# EasyEDA Pro project 8_led_51.eprj

# Schematic 八位LED_51

## Sheets
1 主体: Board Name: Board1; Create Date: 2025-12-03; Page Name: 主体; Project Name: 8_led_51; Schematic Name: 八位LED_51; Update Date: 2025-12-07; Company: 嘉立创EDA; Page Size: A4; Version: V1.0
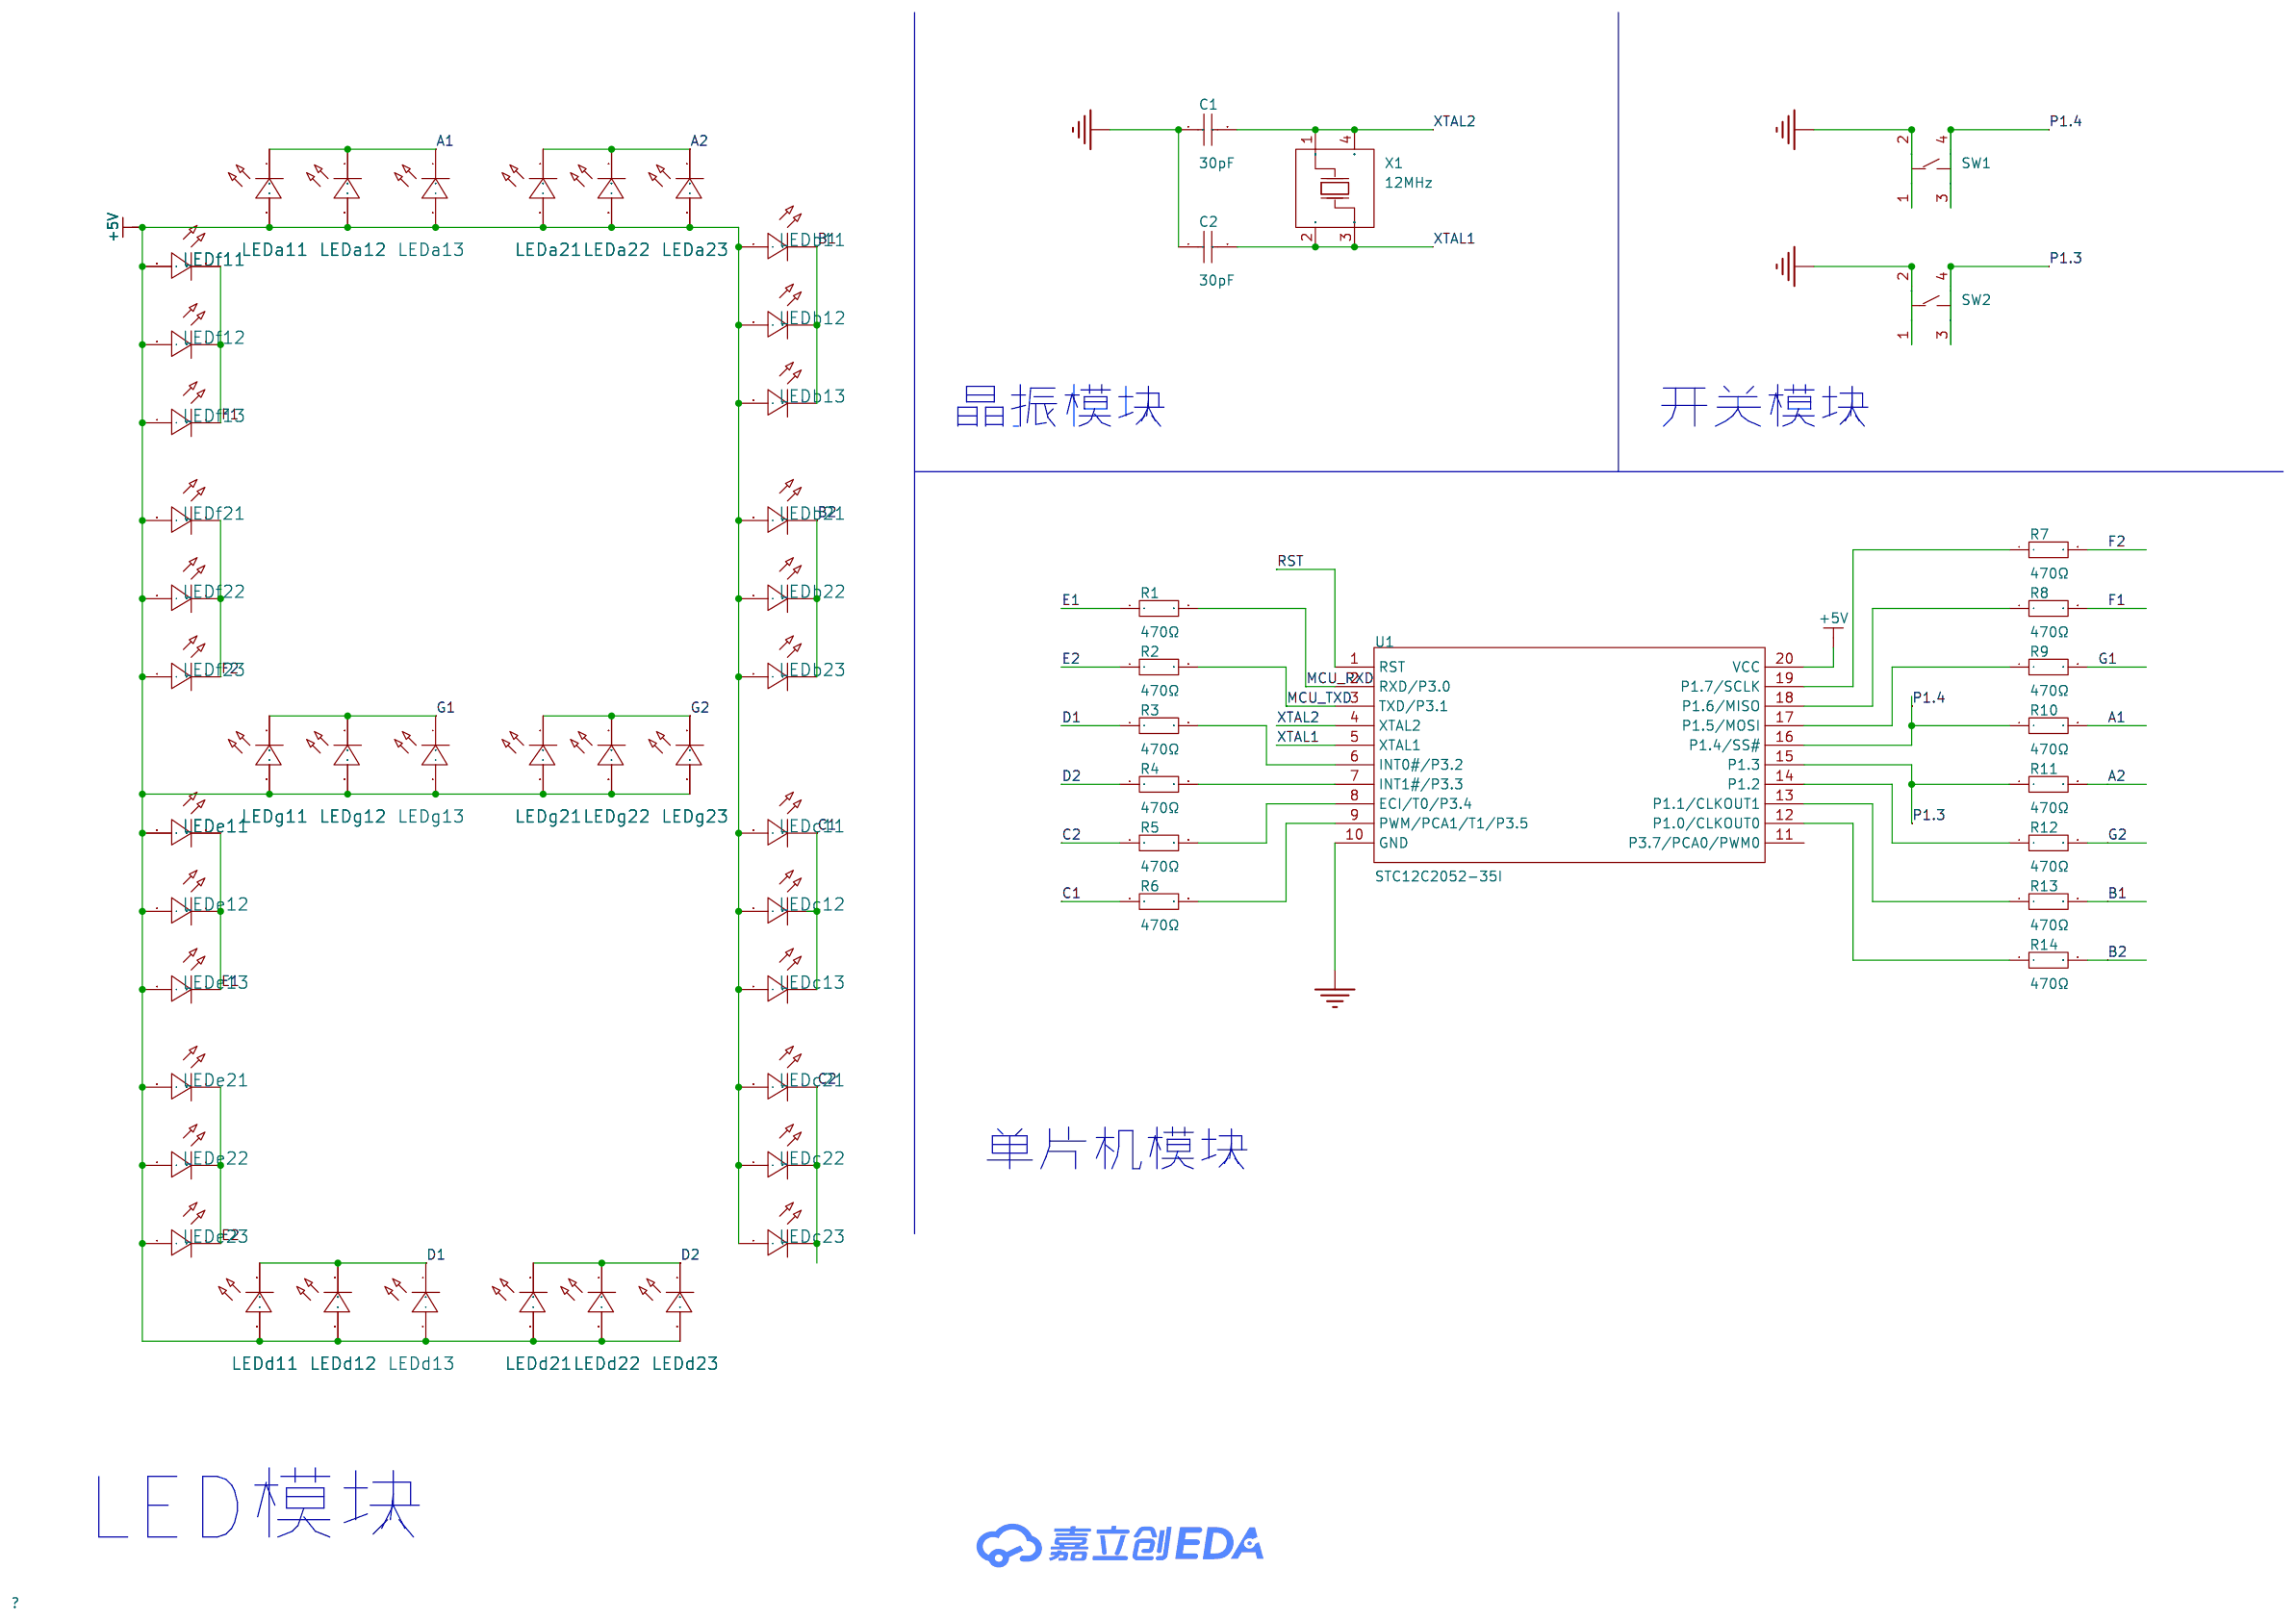
[diagram p0: 主体]
2 P2: Create Date: 2025-12-06; Page Name: P2
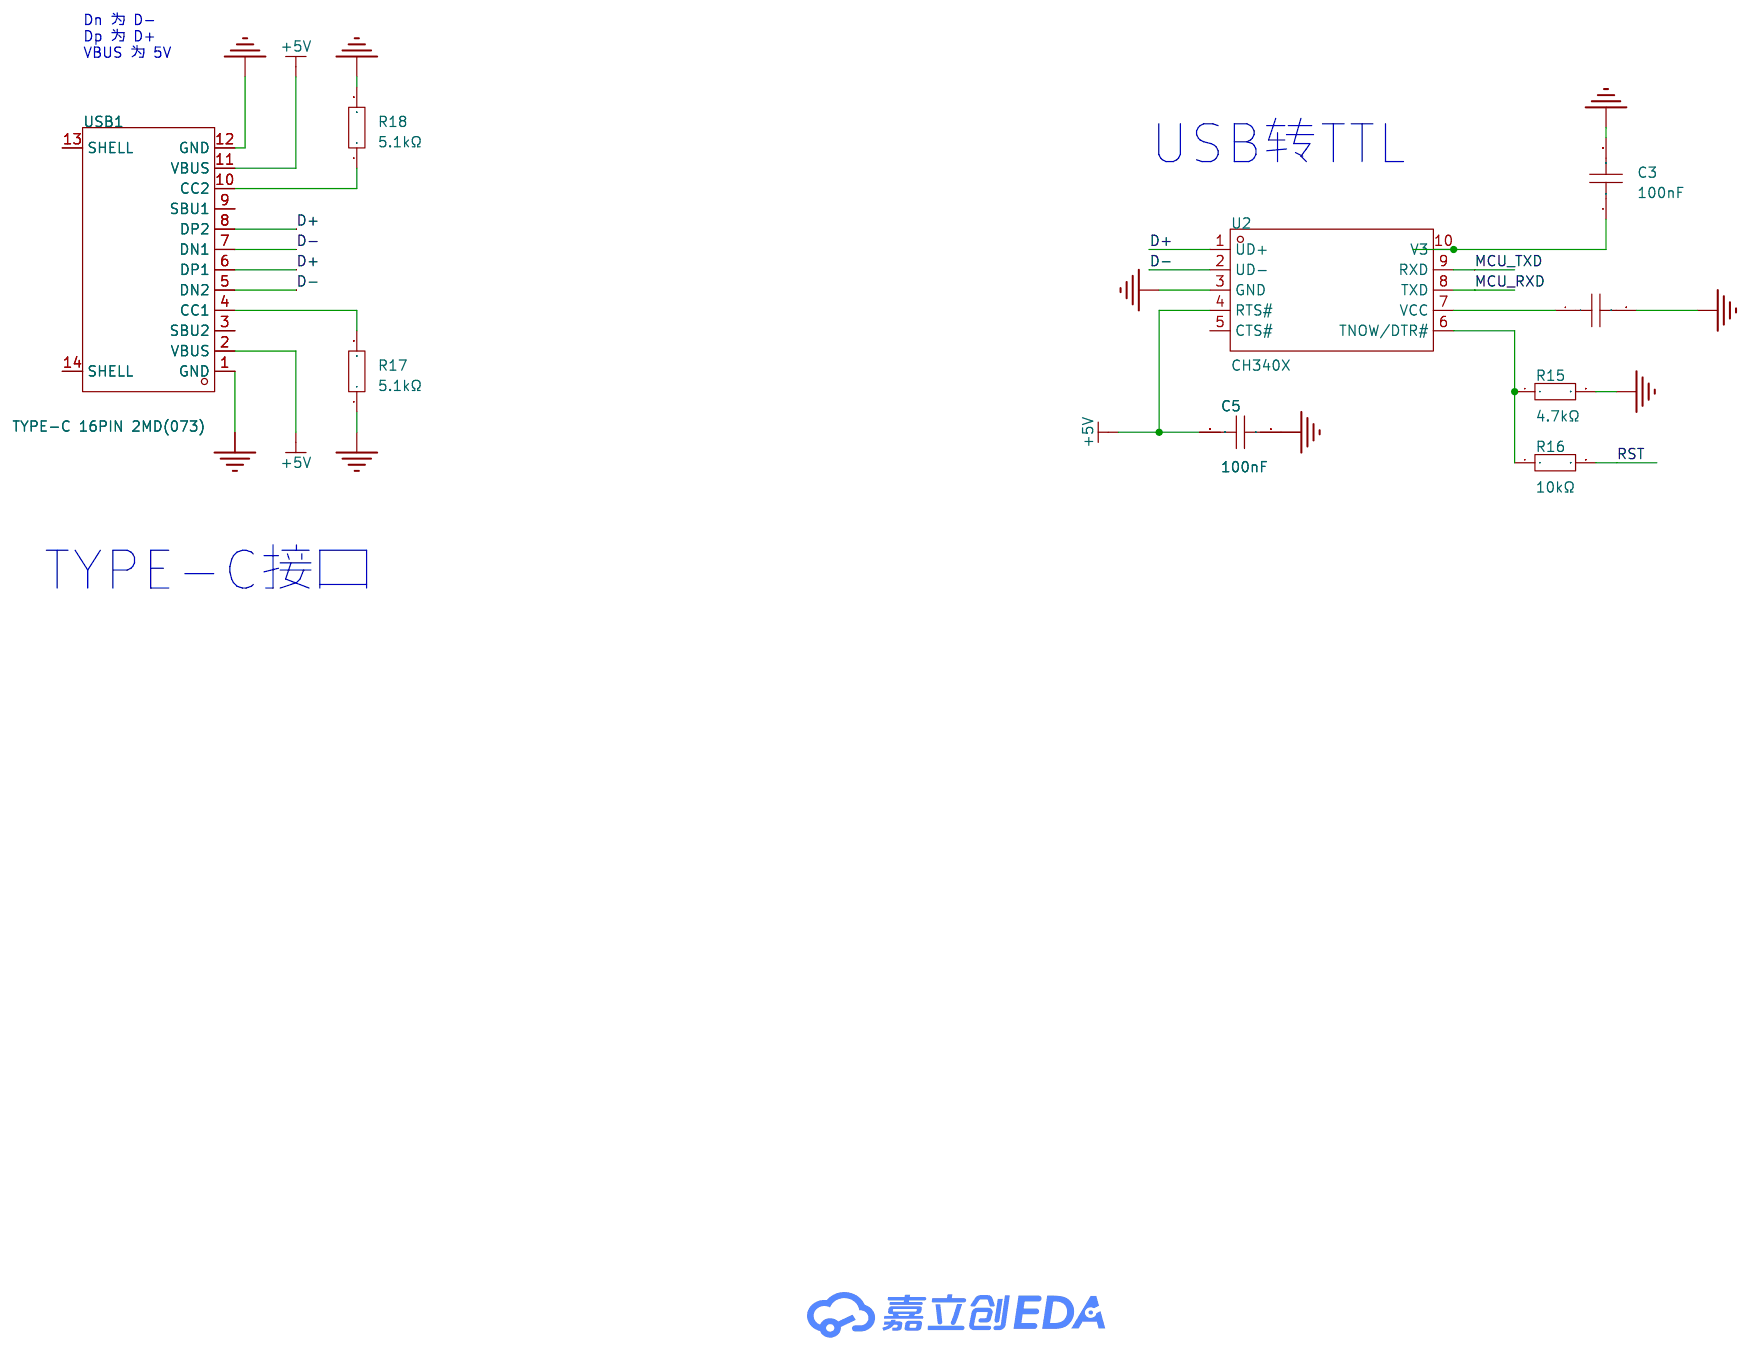
[diagram p1: P2]

## Parts
sheet P2
C3  100nF  [C0805]
C4  100nF  [C0805]
C5  100nF  [C0805]
R15  4.7kΩ  [R0805]
R16  10kΩ  [R0805]
R17  5.1kΩ  [R0805]
R18  5.1kΩ  [R0805]
U2  CH340X  [MSOP-10_L3.0-W3.0-P0.50-LS5.0-BL]
USB1  TYPE-C 16PIN 2MD(073)  [USB-C-SMD_TYPE-C-6PIN-2MD-073]
sheet 主体
C1  30pF  [C0805]
C2  30pF  [C0805]
LEDa11  -  [LED_0805]
LEDa12  -  [LED_0805]
LEDa13  -  [LED_0805]
LEDa21  -  [LED_0805]
LEDa22  -  [LED_0805]
LEDa23  -  [LED_0805]
LEDb11  -  [LED_0805]
LEDb12  -  [LED_0805]
LEDb13  -  [LED_0805]
LEDb21  -  [LED_0805]
LEDb22  -  [LED_0805]
LEDb23  -  [LED_0805]
LEDc11  -  [LED_0805]
LEDc12  -  [LED_0805]
LEDc13  -  [LED_0805]
LEDc21  -  [LED_0805]
LEDc22  -  [LED_0805]
LEDc23  -  [LED_0805]
LEDd11  -  [LED_0805]
LEDd12  -  [LED_0805]
LEDd13  -  [LED_0805]
LEDd21  -  [LED_0805]
LEDd22  -  [LED_0805]
LEDd23  -  [LED_0805]
LEDe11  -  [LED_0805]
LEDe12  -  [LED_0805]
LEDe13  -  [LED_0805]
LEDe21  -  [LED_0805]
LEDe22  -  [LED_0805]
LEDe23  -  [LED_0805]
LEDf11  -  [LED_0805]
LEDf12  -  [LED_0805]
LEDf13  -  [LED_0805]
LEDf21  -  [LED_0805]
LEDf22  -  [LED_0805]
LEDf23  -  [LED_0805]
LEDg11  -  [LED_0805]
LEDg12  -  [LED_0805]
LEDg13  -  [LED_0805]
LEDg21  -  [LED_0805]
LEDg22  -  [LED_0805]
LEDg23  -  [LED_0805]
R1  470Ω  [R0805]
R2  470Ω  [R0805]
R3  470Ω  [R0805]
R4  470Ω  [R0805]
R5  470Ω  [R0805]
R6  470Ω  [R0805]
R7  470Ω  [R0805]
R8  470Ω  [R0805]
R9  470Ω  [R0805]
R10  470Ω  [R0805]
R11  470Ω  [R0805]
R12  470Ω  [R0805]
R13  470Ω  [R0805]
R14  470Ω  [R0805]
SW1  KH-6X6X5H-STM  [SW-SMD_4P-L6.0-W6.0-P4.50-LS9.0_H5.0]
SW2  KH-6X6X5H-STM  [SW-SMD_4P-L6.0-W6.0-P4.50-LS9.0_H5.0]
U1  STC12C2052-35I  [SOIC-20_L13.0-W7.6-P1.27-LS10.3-BL]
X1  12MHz  [CRYSTAL-SMD_4P-L3.2-W2.5-BL]

## Library data of the parts
C3-C5 = CL21B104KBCNNNC: LCSC Part Name: 100nF ±10% 50V; Supplier Part: C1711; Manufacturer: SAMSUNG(三星); Supplier Footprint: 0805; JLCPCB Part Class: Extended Part; Datasheet: https://item.szlcsc.com/datasheet/CL21B104KBCNNNC/2063.html; Supplier: LCSC; Tolerance: ±10%; Voltage Rating: 50V; Temperature Coefficient: X7R
R15 = 0805W8F4701T5E: LCSC Part Name: 4.7kΩ ±1% 125mW 厚膜电阻; Supplier Part: C17673; Manufacturer: UNI-ROYAL(厚声); Supplier Footprint: 0805; JLCPCB Part Class: 基础库; Datasheet: https://atta.szlcsc.com/upload/public/pdf/source/20200306/C422600_1E6D84923E4A46A82E41ADD87F860B5C.pdf; Supplier: LCSC; Type: 厚膜电阻; Tolerance: ±1%; Power(Watts): 125mW; Overload Voltage (Max): 150V; Temperature Coefficient: ±100ppm/℃; Operating Temperature Range: -55℃~+155℃
R16 = 0805W8F1002T5E_C17414: LCSC Part Name: 10kΩ ±1% 125mW 厚膜电阻; Supplier Part: C17414; Manufacturer: UNI-ROYAL(厚声); Manufacturer Part: 0805W8F1002T5E; Supplier Footprint: 0805; JLCPCB Part Class: 基础库; Datasheet: https://item.szlcsc.com/datasheet/0805W8F1002T5E/18102.html; Supplier: LCSC; Type: 厚膜电阻; Tolerance: ±1%; Power(Watts): 125mW; Voltage-Supply(Max): 150V; Temperature Coefficient: ±100ppm/℃; Operating Temperature: -55℃~+155℃
R17 R18 = 0805W8F5101T5E: LCSC Part Name: 5.1kΩ ±1% 125mW 厚膜电阻; Supplier Part: C27834; Manufacturer: UNI-ROYAL(厚声); Supplier Footprint: 0805; JLCPCB Part Class: 基础库; Datasheet: https://item.szlcsc.com/datasheet/0805W8F5101T5E/28584.html; Supplier: LCSC; Type: 厚膜电阻; Tolerance: ±1%; Power(Watts): 125mW; Voltage-Supply(Max): 150V; Temperature Coefficient: ±100ppm/℃; Operating Temperature: -55℃~+155℃
U2 = CH340X: Supplier Part: C3035748; Manufacturer: WCH(南京沁恒); Supplier Footprint: MSOP-10; JLCPCB Part Class: 扩展库; Datasheet: https://item.szlcsc.com/datasheet/CH340X/3584030.html; Supplier: LCSC; Applications Function: USB转串口；USB转并口; USB Protocol: USB 2.0; Voltage - Supply: 3.3V；5V; Data Rate: 2Mbps; Operating Temperature: -40℃~+85℃
USB1 = TYPE-C 16PIN 2MD(073): LCSC Part Name: Type-C 母 卧贴; Supplier Part: C2765186; Manufacturer: SHOU HAN(首韩); Supplier Footprint: SMD; JLCPCB Part Class: 扩展库; Datasheet: https://item.szlcsc.com/datasheet/TYPE-C%252016PIN%25202MD(073)/2901843.html; Supplier: LCSC; Connector Type: Type-C; Gender: 母; Mounting Type: 卧贴; Number of Contacts: 16P; Number of Ports: 1; Current Rating-Power: 3A; Voltage Rating: 5V; Connect-Disconnect Life: 5千次; Detection color: 黑色; Operating Temperature: -25℃~+85℃
C1 C2 = 0805CG300J500NT: LCSC Part Name: 30pF ±5% 50V; Supplier Part: C43094; Manufacturer: FH(风华); Supplier Footprint: 0805; JLCPCB Part Class: 扩展库; Datasheet: https://atta.szlcsc.com/upload/public/pdf/source/20200305/C486355_26A10D38EF8C2A5C37091D0039909270.pdf; Supplier: LCSC; Tolerance: ±5%; Voltage Rating: 50V; Temperature Coefficient: C0G
LEDa11-LEDa13 LEDa21-LEDa23 LEDb11-LEDb13 LEDb21-LEDb23 LEDc11-LEDc13 LEDc21-LEDc23 LEDd11-LEDd13 LEDd21-LEDd23 LEDe11-LEDe13 LEDe21-LEDe23 LEDf11-LEDf13 LEDf21-LEDf23 LEDg11-LEDg13 LEDg21-LEDg23 = LED_0805-R: Supplier Footprint: 0805
R1-R14 = 0805W8F4700T5E: LCSC Part Name: 470Ω ±1% 125mW 厚膜电阻; Supplier Part: C17710; Manufacturer: UNI-ROYAL(厚声); Supplier Footprint: 0805; JLCPCB Part Class: 基础库; Datasheet: https://item.szlcsc.com/datasheet/0805W8F4700T5E/18398.html; Supplier: LCSC; Type: 厚膜电阻; Tolerance: ±1%; Power(Watts): 125mW; Voltage-Supply(Max): 150V; Temperature Coefficient: ±100ppm/℃; Operating Temperature: -55℃~+155℃
SW1 SW2 = KH-6X6X5H-STM: LCSC Part Name: 6*6*5mm 立贴 轻触开关; Supplier Part: C2837531; Manufacturer: kinghelm(金航标); Supplier Footprint: SMD-4P,6x6mm; JLCPCB Part Class: 扩展库; Datasheet: https://item.szlcsc.com/datasheet/KH-6X6X5H-STM/3009601.html; Supplier: LCSC; Circuit: 单刀单掷; Actuator Style: 圆形按钮; Mounting Type: 立贴; Length: 6mm; Width: 6mm; Switch Height: 5mm; with Bracket: 不带支架; Contact Current: 50mA; Voltage Rating: 12V; Actuator/Cap Color: 黑色; Termination Style: 鸥翼型; Life: 8万次
U1 = STC12C2052-35I: Supplier Part: C8718; Manufacturer: STC; Supplier Footprint: SOIC-20-300mil; JLCPCB Part Class: 扩展库; Datasheet: https://atta.szlcsc.com/upload/public/pdf/source/20120807/1457706521534.pdf; Supplier: LCSC; CPU Core: 51系列; CPU Maximum Speed: 35MHz; Program Storage Size: 2KB; Program Memory Type: FLASH; Number of I/O: 15; Low Voltage Detection Threshold: 3.5V~5.5V
X1 = X322512MSB4SI: LCSC Part Name: YSX321SL 12MHZ 4P 3225 20PF ±10PPM -40~85℃ (±20PPM); Supplier Part: C9002; Manufacturer: YXC(扬兴晶振); Supplier Footprint: SMD3225-4P; JLCPCB Part Class: 基础库; Datasheet: https://item.szlcsc.com/datasheet/X322512MSB4SI/9522.html; Supplier: LCSC; Type: 贴片晶振; Normal temperature Frequency Tolerance: ±10ppm; Load Capacitance: 20pF; Frequency Stability: ±20ppm; Operating Temperature: -40℃~+85℃

## Nets
+5V: C5.2 LEDa11.2(A) LEDa12.2(A) LEDa13.2(A) LEDa21.2(A) LEDa22.2(A) LEDa23.2(A) LEDb11.2(A) LEDb12.2(A) LEDb13.2(A) LEDb21.2(A) LEDb22.2(A) LEDb23.2(A) LEDc11.2(A) LEDc12.2(A) LEDc13.2(A) LEDc21.2(A) LEDc22.2(A) LEDc23.2(A) LEDd11.2(A) LEDd12.2(A) LEDd13.2(A) LEDd21.2(A) LEDd22.2(A) LEDd23.2(A) LEDe11.2(A) LEDe12.2(A) LEDe13.2(A) LEDe21.2(A) LEDe22.2(A) LEDe23.2(A) LEDf11.2(A) LEDf12.2(A) LEDf13.2(A) LEDf21.2(A) LEDf22.2(A) LEDf23.2(A) LEDg11.2(A) LEDg12.2(A) LEDg13.2(A) LEDg21.2(A) LEDg22.2(A) LEDg23.2(A) U1.20(VCC) U2.4(RTS#) USB1.2(VBUS) USB1.11(VBUS)
GND: C1.1 C2.1 C3.2 C4.2 C5.1 R15.2 R17.1 R18.2 SW1.1 SW1.2 SW2.1 SW2.2 U1.10(GND) U2.3(GND) USB1.1(GND) USB1.12(GND)
A1: LEDa11.1(C) LEDa12.1(C) LEDa13.1(C) R10.2
A2: LEDa21.1(C) LEDa22.1(C) LEDa23.1(C) R11.2
B1: LEDb11.1(C) LEDb12.1(C) LEDb13.1(C) R13.2
B2: LEDb21.1(C) LEDb22.1(C) LEDb23.1(C) R14.2
C1: LEDc11.1(C) LEDc12.1(C) LEDc13.1(C) R6.1
C2: LEDc21.1(C) LEDc22.1(C) LEDc23.1(C) R5.1
D1: LEDd11.1(C) LEDd12.1(C) LEDd13.1(C) R3.1
D2: LEDd21.1(C) LEDd22.1(C) LEDd23.1(C) R4.1
D+: U2.1(UD+) USB1.6(DP1) USB1.8(DP2)
D-: U2.2(UD-) USB1.5(DN2) USB1.7(DN1)
E1: LEDe11.1(C) LEDe12.1(C) LEDe13.1(C) R1.1
E2: LEDe21.1(C) LEDe22.1(C) LEDe23.1(C) R2.1
F1: LEDf11.1(C) LEDf12.1(C) LEDf13.1(C) R8.2
F2: LEDf21.1(C) LEDf22.1(C) LEDf23.1(C) R7.2
G1: LEDg11.1(C) LEDg12.1(C) LEDg13.1(C) R9.2
G2: LEDg21.1(C) LEDg22.1(C) LEDg23.1(C) R12.2
MCU_RXD: R1.2 U1.2(RXD/P3.0) U2.8(TXD)
MCU_TXD: R2.2 U1.3(TXD/P3.1) U2.9(RXD)
P1.3: R11.1 SW2.3 SW2.4 U1.15(P1.3)
P1.4: R10.1 SW1.3 SW1.4 U1.16(P1.4/SS#)
RST: R16.2 U1.1(RST)
XTAL1: C2.2 U1.5(XTAL1) X1.2(GND) X1.3(OSC2)
XTAL2: C1.2 U1.4(XTAL2) X1.1(OSC1) X1.4(GND)
$1N3494: R3.2 U1.6(INT0#/P3.2)
$1N3501: R4.2 U1.7(INT1#/P3.3)
$1N3506: R5.2 U1.8(ECI/T0/P3.4)
$1N3513: R6.2 U1.9(PWM/PCA1/T1/P3.5)
$1N3908: R7.1 U1.19(P1.7/SCLK)
$1N3914: R8.1 U1.18(P1.6/MISO)
$1N3950: R9.1 U1.17(P1.5/MOSI)
$1N3974: R12.1 U1.14(P1.2)
$1N3981: R13.1 U1.13(P1.1/CLKOUT1)
$1N3991: R14.1 U1.12(P1.0/CLKOUT0)
$2N475: C3.1 U2.10(V3)
$2N528: C4.1 U2.7(VCC)
$2N806: R15.1 R16.1 U2.6(TNOW/DTR#)
$2N1309: R17.2 USB1.4(CC1)
$2N1314: R18.1 USB1.10(CC2)

Not connected (* = marked no-connect by the designer): U1 11(P3.7/PCA0/PWM0); U2 5(CTS#); USB1 3(SBU2) 9(SBU1) 13(SHELL) 14(SHELL)

## Notes on the sheets
sheet 1
- 晶振模块
- 开关模块
- 单片机模块
- LED模块
sheet 2
- Dn 为 D-
  Dp 为 D+
  VBUS 为 5V
- USB转TTL
- TYPE-C接口

# Board PCB1
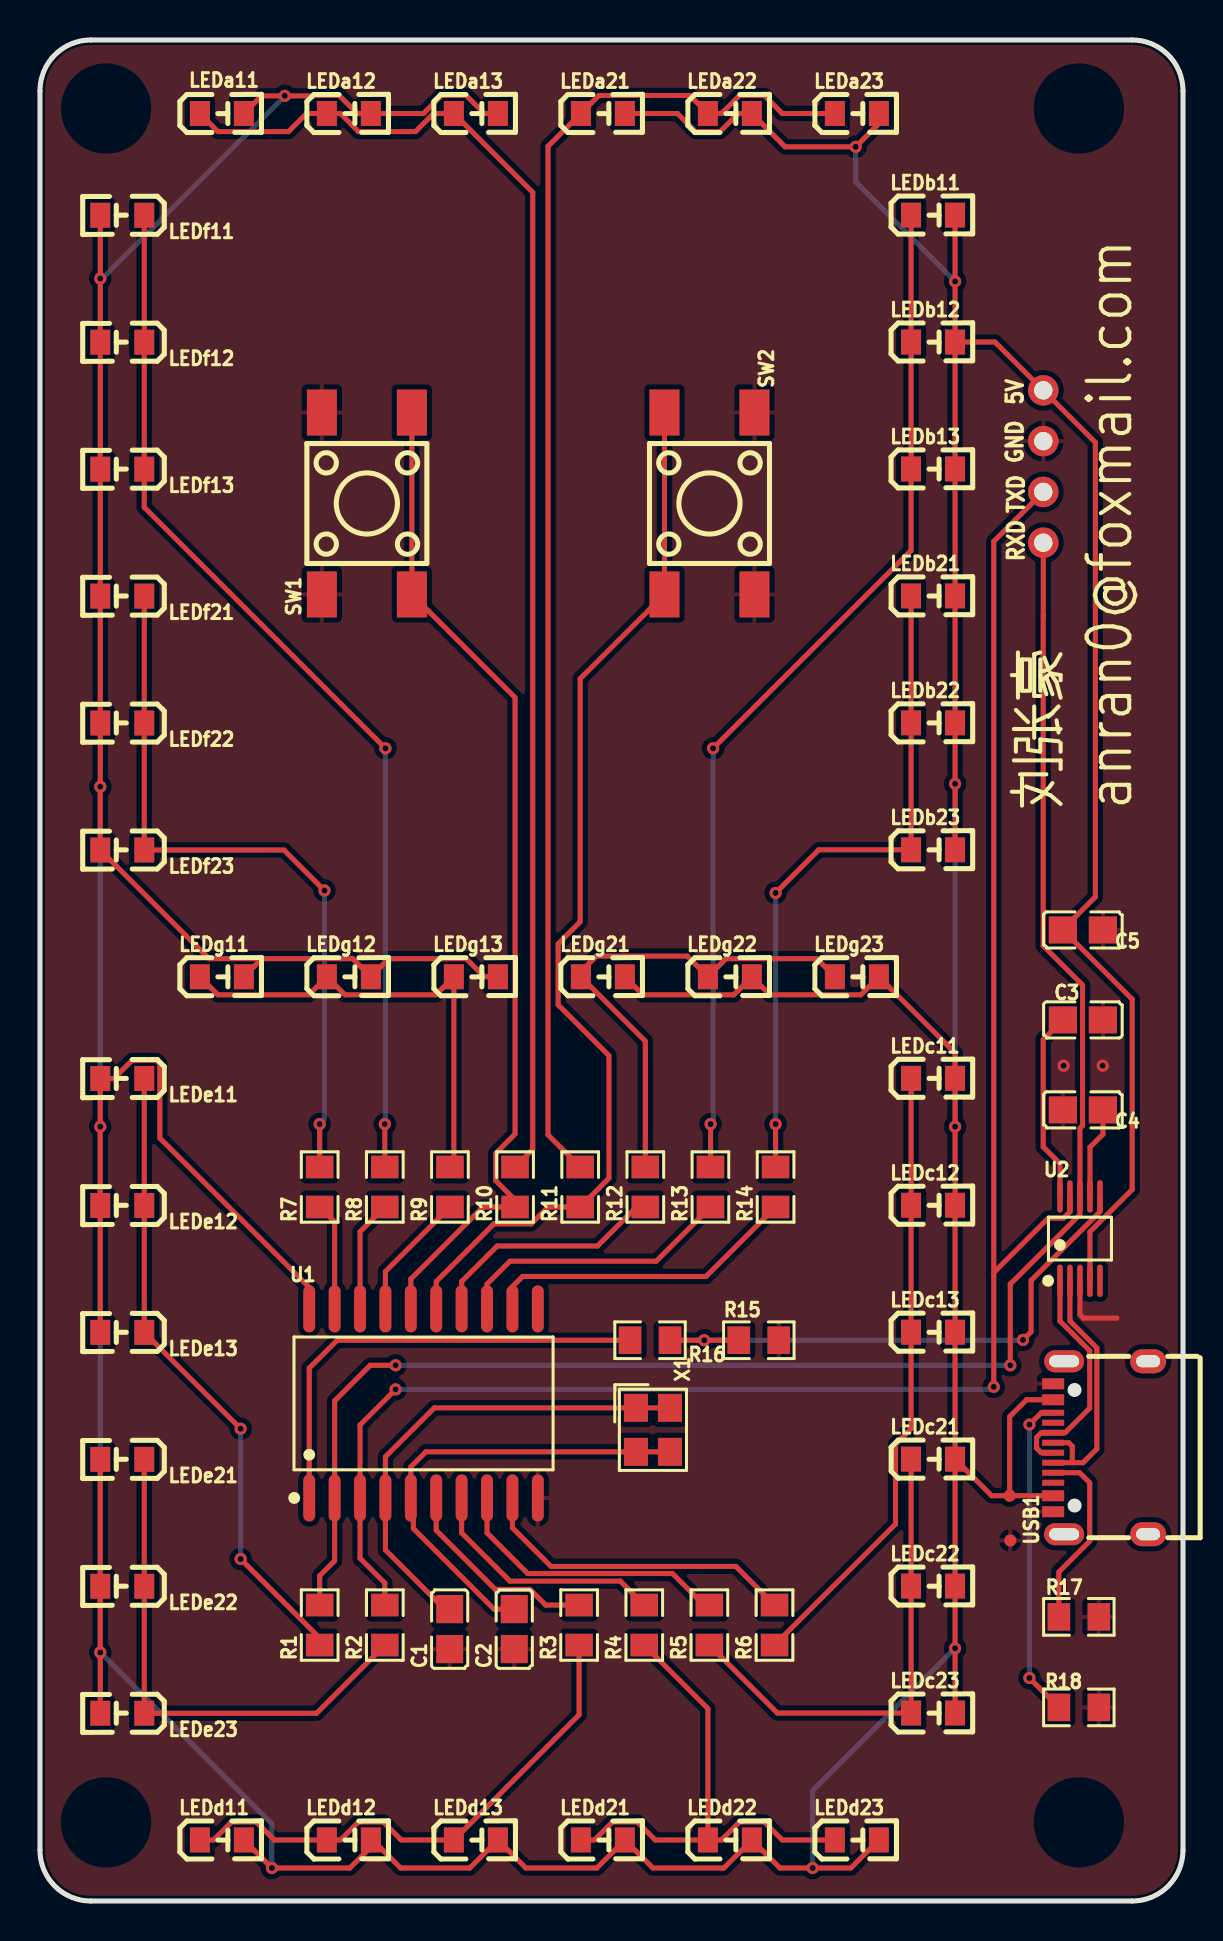
[diagram p2: board, top side]
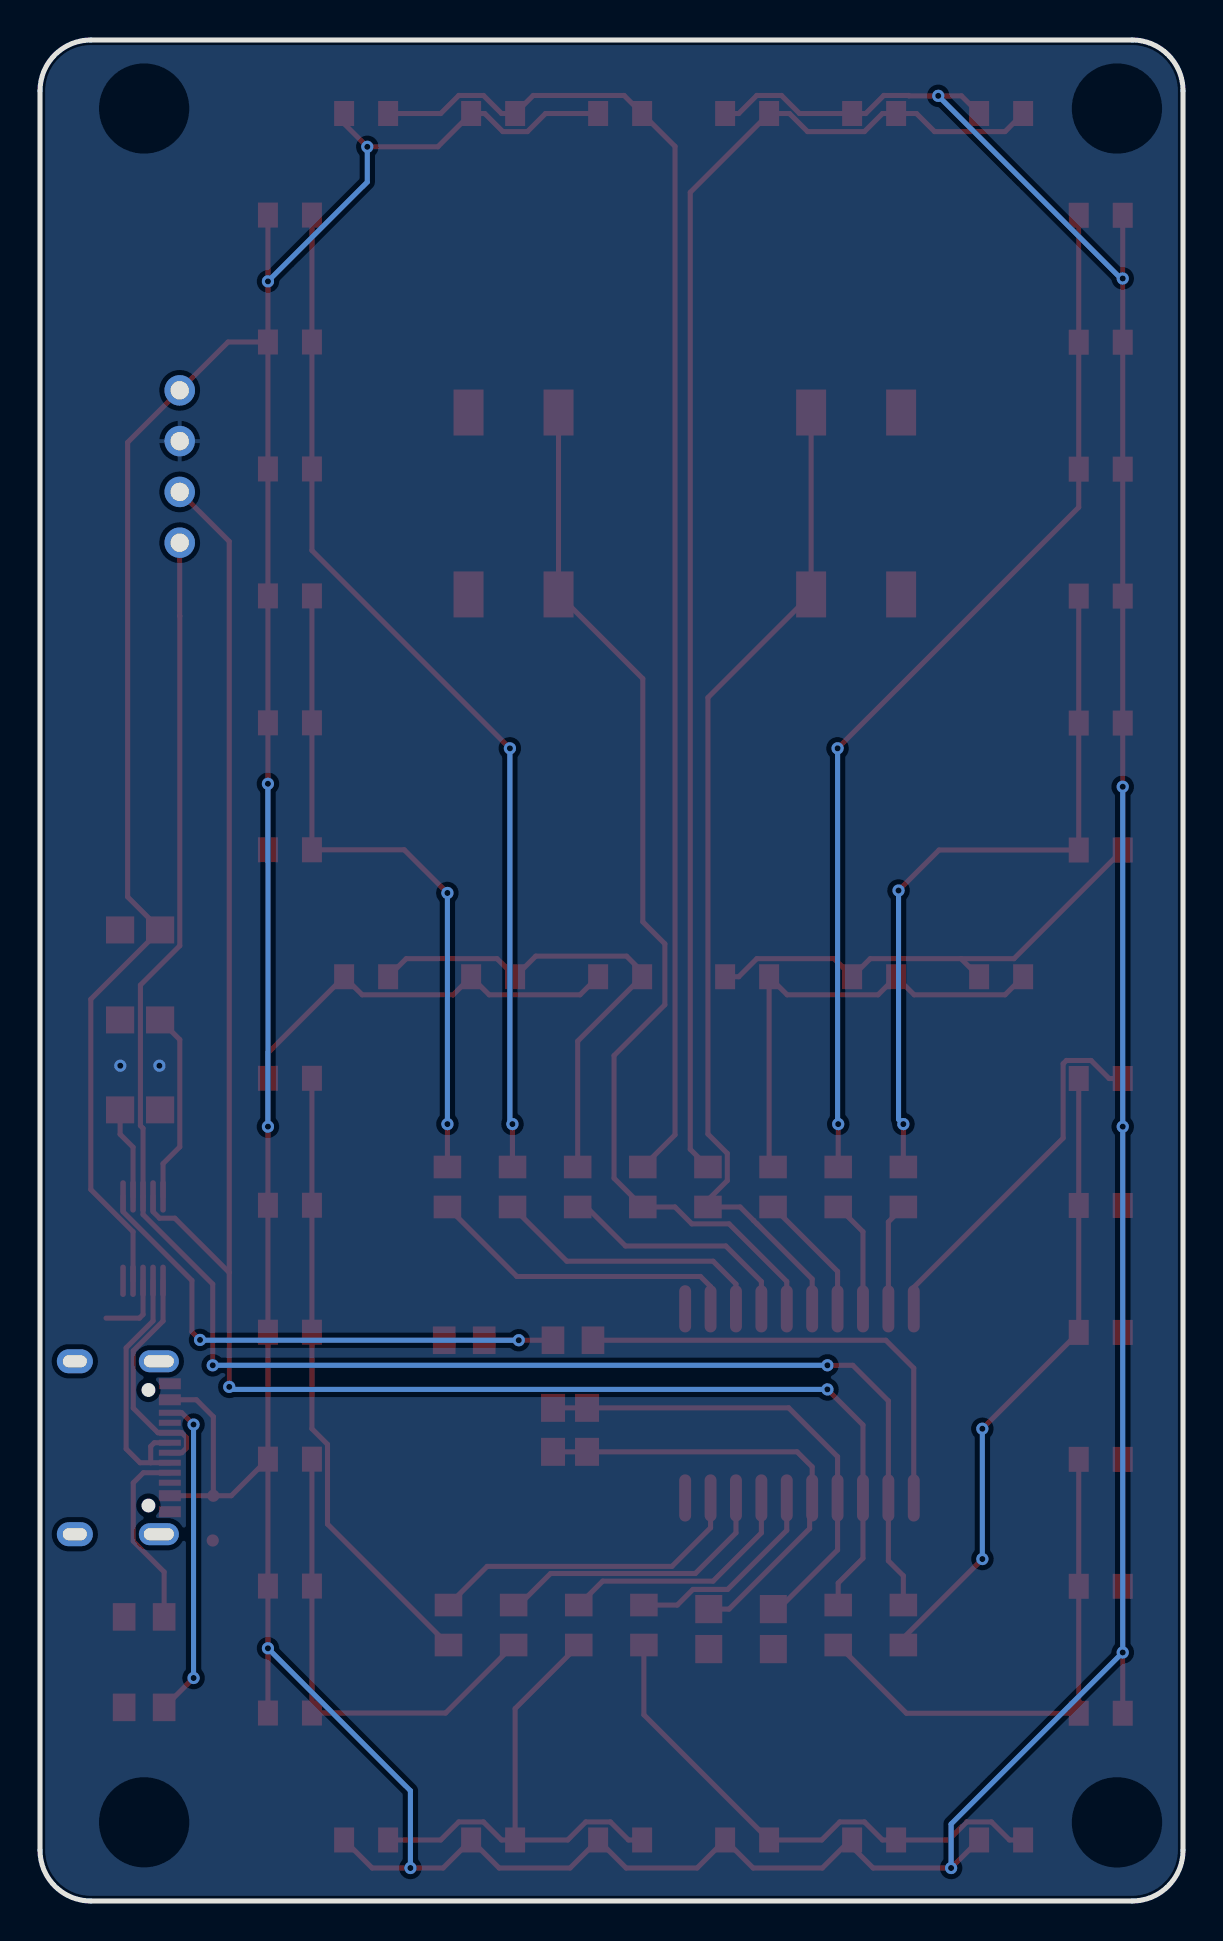
[diagram p3: board, bottom side, seen from below]

Outline 57.15 x 93.09 mm; copper layers: Top Layer, Bottom Layer. Coordinates in mm from the lower left corner of the outline.
Outline path: 0,90.55 0,2.54 arc(0.74,0.74) 2.54,0 54.61,0 arc(56.41,0.74) 57.15,2.54 57.15,90.55 arc(56.41,92.35) 54.61,93.09 2.54,93.09 arc(0.74,92.35) 0,90.55
Stack: Top Layer 0.035mm / Dielectric1 1.51mm FR4 er 4.5 / Bottom Layer 0.035mm

## Design rules (mm)
template: JLCPCB Capability(Two Layers Board)
spacing copperThickness1oz (default): track to track 0.102, other pairs 0.152 to 0.3
spacing copperThickness2oz: track to track 0.203, other pairs 0.152 to 0.3
track width copperThickness1oz (default): min 0.127, default 0.254, max 2.54
track width copperThickness2oz: min 0.203, default 0.254, max 2.54
differential pair differentialPair (default): width min 0.127, default 0.254, max 2.54; gap min 0.152, default 0.152
via viaSize (default): diameter min 0.5, default 0.61, max 10; hole min 0.3, default 0.305, max 6.3

## Placement (name value [footprint] x y rotation side)
C1  30pF  [C0805]  20.48 13.6 90 top
C2  30pF  [C0805]  23.71 13.6 90 top
C3  100nF  [C0805]  52.15 44.07 0 top
C4  100nF  [C0805]  52.15 39.57 180 top
C5  100nF  [C0805]  52.15 48.57 180 top
LEDa11  NCD0805R1  [LED_0805]  9.14 89.41 0 top
LEDa12  NCD0805R1  [LED_0805]  15.49 89.41 0 top
LEDa13  NCD0805R1  [LED_0805]  21.84 89.41 0 top
LEDa21  NCD0805R1  [LED_0805]  28.19 89.41 0 top
LEDa22  NCD0805R1  [LED_0805]  34.54 89.41 0 top
LEDa23  NCD0805R1  [LED_0805]  40.89 89.41 0 top
LEDb11  NCD0805R1  [LED_0805]  44.7 84.33 0 top
LEDb12  NCD0805R1  [LED_0805]  44.7 77.98 0 top
LEDb13  NCD0805R1  [LED_0805]  44.7 71.63 0 top
LEDb21  NCD0805R1  [LED_0805]  44.7 65.28 0 top
LEDb22  NCD0805R1  [LED_0805]  44.7 58.93 0 top
LEDb23  NCD0805R1  [LED_0805]  44.7 52.58 0 top
LEDc11  NCD0805R1  [LED_0805]  44.7 41.15 0 top
LEDc12  NCD0805R1  [LED_0805]  44.7 34.8 0 top
LEDc13  NCD0805R1  [LED_0805]  44.7 28.45 0 top
LEDc21  NCD0805R1  [LED_0805]  44.7 22.1 0 top
LEDc22  NCD0805R1  [LED_0805]  44.7 15.75 0 top
LEDc23  NCD0805R1  [LED_0805]  44.7 9.4 0 top
LEDd11  NCD0805R1  [LED_0805]  9.14 3.05 0 top
LEDd12  NCD0805R1  [LED_0805]  15.49 3.05 0 top
LEDd13  NCD0805R1  [LED_0805]  21.84 3.05 0 top
LEDd21  NCD0805R1  [LED_0805]  28.19 3.05 0 top
LEDd22  NCD0805R1  [LED_0805]  34.54 3.05 0 top
LEDd23  NCD0805R1  [LED_0805]  40.89 3.05 0 top
LEDe11  NCD0805R1  [LED_0805]  4.06 41.15 180 top
LEDe12  NCD0805R1  [LED_0805]  4.06 34.8 180 top
LEDe13  NCD0805R1  [LED_0805]  4.06 28.45 180 top
LEDe21  NCD0805R1  [LED_0805]  4.06 22.1 180 top
LEDe22  NCD0805R1  [LED_0805]  4.06 15.75 180 top
LEDe23  NCD0805R1  [LED_0805]  4.06 9.4 180 top
LEDf11  NCD0805R1  [LED_0805]  4.06 84.33 180 top
LEDf12  NCD0805R1  [LED_0805]  4.06 77.98 180 top
LEDf13  NCD0805R1  [LED_0805]  4.06 71.63 180 top
LEDf21  NCD0805R1  [LED_0805]  4.06 65.28 180 top
LEDf22  NCD0805R1  [LED_0805]  4.06 58.93 180 top
LEDf23  NCD0805R1  [LED_0805]  4.06 52.58 180 top
LEDg11  NCD0805R1  [LED_0805]  9.14 46.23 0 top
LEDg12  NCD0805R1  [LED_0805]  15.49 46.23 0 top
LEDg13  NCD0805R1  [LED_0805]  21.84 46.23 0 top
LEDg21  NCD0805R1  [LED_0805]  28.19 46.23 0 top
LEDg22  NCD0805R1  [LED_0805]  34.54 46.23 0 top
LEDg23  NCD0805R1  [LED_0805]  40.89 46.23 0 top
NOREF  -  [Pad_e1980]  50.16 67.95 0 top
NOREF#2  -  [Pad_e2063]  50.16 75.56 0 top
NOREF#3  -  [Pad_e1946]  48.48 20.27 0 top
NOREF#4  -  [Pad_e1947]  48.51 18.03 0 top
NOREF#5  -  [Pad_e2044]  50.16 70.48 0 top
NOREF#6  -  [Pad_e2062]  50.16 73.03 0 top
R1  470Ω  [R0805]  13.98 13.8 90 top
R2  470Ω  [R0805]  17.24 13.8 90 top
R3  470Ω  [R0805]  26.96 13.8 90 top
R4  470Ω  [R0805]  30.21 13.8 90 top
R5  470Ω  [R0805]  33.47 13.8 90 top
R6  470Ω  [R0805]  36.73 13.8 90 top
R7  470Ω  [R0805]  13.98 35.72 90 top
R8  470Ω  [R0805]  17.24 35.72 90 top
R9  470Ω  [R0805]  20.5 35.72 90 top
R10  470Ω  [R0805]  23.75 35.72 90 top
R11  470Ω  [R0805]  27.01 35.72 90 top
R12  470Ω  [R0805]  30.27 35.72 90 top
R13  470Ω  [R0805]  33.52 35.72 90 top
R14  470Ω  [R0805]  36.78 35.72 90 top
R15  4.7kΩ  [R0805]  35.94 28.05 0 top
R16  10kΩ  [R0805]  30.5 28.05 180 top
R17  5.1kΩ  [R0805]  51.94 14.21 180 top
R18  5.1kΩ  [R0805]  51.94 9.69 0 top
SW1  KH-6X6X5H-STM  [SW-SMD_4P-L6.0-W6.0-P4.50-LS9.0_H5.0]  16.34 69.91 90 top
SW2  KH-6X6X5H-STM  [SW-SMD_4P-L6.0-W6.0-P4.50-LS9.0_H5.0]  33.47 69.91 270 top
U1  STC12C2052-35I  [SOIC-20_L13.0-W7.6-P1.27-LS10.3-BL]  19.18 24.89 0 top
U2  CH340X  [MSOP-10_L3.0-W3.0-P0.50-LS5.0-BL]  52 33.13 0 top
USB1  TYPE-C 16PIN 2MD(073)  [USB-C-SMD_TYPE-C-6PIN-2MD-073]  53.03 22.67 90 top
X1  12MHz  [CRYSTAL-SMD_4P-L3.2-W2.5-BL]  30.65 23.57 270 top

## Footprints (pads in the part's own frame, mm; a bottom-side part is the same pattern mirrored in y, then rotated)
C0805
  rect 1.41x1.35 smd: 1(-1,0) 2(1,0)
CRYSTAL-SMD_4P-L3.2-W2.5-BL
  rect 1.4x1.2 smd: 1(-1.1,-0.85) 2(1.1,-0.85) 3(1.1,0.85) 4(-1.1,0.85)
LED_0805
  rect 1x1.25 smd: 1(-1.15,0.005) 2(1.05,0.005)
MSOP-10_L3.0-W3.0-P0.50-LS5.0-BL
  oval 0.28x1.62 smd: 1(-1,-2.11) 2(-0.5,-2.11) 3(0,-2.11) 4(0.5,-2.11) 5(1,-2.11) 6(1,2.11) 7(0.5,2.11) 8(0,2.11) 9(-0.5,2.11) 10(-1,2.11)
Pad_e1946
  round 0.61 smd: TP1(0,0)
Pad_e1947
  round 0.61 smd: TP2(0,0)
Pad_e1980
  round 1.524 hole 0.914: 1(0,0)
Pad_e2044
  round 1.524 hole 0.914: 1(0,0)
Pad_e2062
  round 1.524 hole 0.914: 1(0,0)
Pad_e2063
  round 1.524 hole 0.914: 1(0,0)
R0805
  rect 1.133x1.377 smd: 1(-1,0) 2(1,0)
SOIC-20_L13.0-W7.6-P1.27-LS10.3-BL
  oval 0.595x2.36 smd: 1(-5.715,-4.73) 2(-4.445,-4.73) 3(-3.175,-4.73) 4(-1.905,-4.73) 5(-0.635,-4.73) 6(0.635,-4.73) 7(1.905,-4.73) 8(3.175,-4.73) 9(4.445,-4.73) 10(5.715,-4.73) 11(5.715,4.73) 12(4.445,4.73) 13(3.175,4.73) 14(1.905,4.73) 15(0.635,4.73) 16(-0.635,4.73) 17(-1.905,4.73) 18(-3.175,4.73) 19(-4.445,4.73) 20(-5.715,4.73)
SW-SMD_4P-L6.0-W6.0-P4.50-LS9.0_H5.0
  rect 2.3x1.5 smd: 1(-4.55,2.25) 2(4.55,2.25) 3(-4.55,-2.25) 4(4.55,-2.25)
USB-C-SMD_TYPE-C-6PIN-2MD-073
  rect 0.55x1.1 smd: 1(-3.2,2.375) 2(-2.4,2.375) 11(2.4,2.375) 12(3.2,2.375)
  rect 0.3x1.1 smd: 3(-1.75,2.375) 4(-1.25,2.375) 5(-0.75,2.375) 6(-0.25,2.375) 7(0.25,2.375) 8(0.75,2.375) 9(1.25,2.375) 10(1.75,2.375)
  oval 1.1x2 hole 0.6x1.5: 13(-4.325,1.825) 14(4.325,1.825)
  oval 1.2x1.8 hole 0.6x1.2: 13(-4.325,-2.375) 14(4.325,-2.375)

## Nets
As in the schematic, except:
+5V: C5.2 LEDa11.2 LEDa12.2 LEDa13.2 LEDa21.2 LEDa22.2 LEDa23.2 LEDb11.2 LEDb12.2 LEDb13.2 LEDb21.2 LEDb22.2 LEDb23.2 LEDc11.2 LEDc12.2 LEDc13.2 LEDc21.2 LEDc22.2 LEDc23.2 LEDd11.2 LEDd12.2 LEDd13.2 LEDd21.2 LEDd22.2 LEDd23.2 LEDe11.2 LEDe12.2 LEDe13.2 LEDe21.2 LEDe22.2 LEDe23.2 LEDf11.2 LEDf12.2 LEDf13.2 LEDf21.2 LEDf22.2 LEDf23.2 LEDg11.2 LEDg12.2 LEDg13.2 LEDg21.2 LEDg22.2 LEDg23.2 NOREF#2.1 NOREF#3.TP1 U1.20 U2.4 USB1.2 USB1.11
GND: C1.1 C2.1 C3.2 C4.2 C5.1 NOREF#4.TP2 NOREF#6.1 R15.2 R17.1 R18.2 SW1.1 SW1.2 SW2.1 SW2.2 U1.10 U2.3 USB1.1 USB1.12
MCU_RXD: NOREF.1 R1.2 U1.2 U2.8
MCU_TXD: NOREF#5.1 R2.2 U1.3 U2.9

Pads without a net: U1 11; U2 5; USB1 3 9 13 14

## Via types
v1: diameter 0.61, hole 0.305, Top Layer to Bottom Layer, 32 vias

## Routing (per net, layer and track width the routed paths; a pad name or vN(x,y) marks a point on that pad's centre or on a via; arc(x,y) is an arc through that point)
+5V: length 428.6
  Top Layer w0.254: U2.4 52.5,33.48 54.61,35.59 54.61,45.11 C5.2 51.15,48.61 52.77,50.23 52.77,72.96 NOREF#2.1 47.75,77.98 LEDb12.2 ; 3.01,9.39 v1(3.01,12.43) LEDe22.2 3.01,22.09 ; LEDb12.2 v1(45.75,81.02) LEDb11.2 ; LEDb12.2 LEDb21.2 v1(45.75,55.88) LEDb23.2 ; LEDd11.2 v1(11.6,1.65) 15.49,1.65 16.54,2.7 LEDd12.2 16.63,3.05 18.03,1.65 21.49,1.65 LEDd13.2 24.3,1.65 27.84,1.65 LEDd21.2 30.65,1.65 34.19,1.65 LEDd22.2 37,1.65 v1(38.63,1.65) 40.54,1.65 LEDd23.2 ; 3.01,28.44 v1(3.01,38.73) 3.01,41.14 3.69,41.14 4.6,42.05 5.83,42.05 5.99,41.88 5.99,38.16 13.46,30.69 U1.20 ; LEDc23.2 v1(45.75,12.64) LEDc21.2 ; LEDg11.2 11.1,47.14 ; 11.1,47.14 8.45,47.14 3.01,52.57 v1(3.01,55.74) LEDf22.2 LEDf13.2 v1(3.01,81.16) 3.01,84.32 ; 11.1,47.14 15.64,47.14 LEDg12.2 17.45,47.14 21.31,47.14 22.21,46.23 LEDg13.2 ; LEDc21.2 47.58,20.27 NOREF#3.TP1 ; LEDc21.2 LEDc13.2 LEDc12.2 v1(45.75,38.73) LEDc11.2 45.75,42.42 LEDg23.2 41.04,45.33 36.5,45.33 LEDg22.2 34.69,45.33 30.15,45.33 LEDg21.2 ; LEDa21.2 31.87,89.41 32.78,88.51 34.01,88.51 34.91,89.41 LEDa22.2 37.26,87.75 v1(40.79,87.75) 41.94,88.91 LEDa23.2 ; LEDa11.2 11.08,90.3 v1(12.24,90.3) 13.71,90.3 13.73,90.32 14.96,90.32 15.86,89.41 LEDa12.2 19.17,89.41 20.08,90.32 21.31,90.32 22.21,89.41 LEDa13.2 ; USB1.11 49.33,25.07 48.48,24.23 NOREF#3.TP1 ; NOREF#3.TP1 USB1.2
  Bottom Layer w0.254: v1(45.75,12.64) 38.63,5.52 v1(38.63,1.65) ; v1(40.79,87.75) 40.79,85.98 v1(45.75,81.02) ; v1(3.01,81.16) 3.1,81.16 v1(12.24,90.3) ; v1(11.6,1.65) 11.6,3.85 v1(3.01,12.43) v1(3.01,38.73) v1(3.01,55.74) ; v1(45.75,55.88) v1(45.75,38.73)
GND: length 3.6
  Top Layer w0.254: U2.3 52,29.34 52.18,29.16 53.85,29.16
  vias: v1(51.18,41.78) v1(53.14,41.78)
A1: length 68.9
  Top Layer w0.254: LEDa11.1 8.9,88.51 12.42,88.51 13.33,89.41 LEDa12.1 15.02,89.41 15.93,88.51 18.77,88.51 19.68,89.41 LEDa13.1 24.64,85.47 24.64,37.6 R10.2
A2: length 68.2
  Top Layer w0.254: R11.2 25.4,38.33 25.4,87.77 LEDa21.1 27.95,90.32 32.49,90.32 LEDa22.1 34.07,89.41 34.98,90.32 36.21,90.32 37.11,89.41 LEDa23.1
B1: length 51.8
  Top Layer w0.254: v1(33.66,57.66) 43.55,67.56 LEDb12.1 LEDb11.1 ; R13.2 33.53,36.72 v1(33.53,38.86)
  Bottom Layer w0.254: v1(33.53,38.86) 33.66,38.99 v1(33.66,57.66)
B2: length 34.1
  Top Layer w0.254: v1(36.78,50.42) 38.94,52.58 LEDb23.1 43.55,58.93 LEDb21.1 ; R14.2 v1(36.78,38.86)
  Bottom Layer w0.254: v1(36.78,50.42) v1(36.78,38.86)
C1: length 31.2
  Top Layer w0.254: R6.1 42.78,18.85 42.78,22.84 43.55,23.62 LEDc13.1 LEDc12.1 LEDc11.1
C2: length 24.2
  Top Layer w0.254: R5.1 36.87,9.4 LEDc23.1 LEDc21.1
D1: length 26.5
  Top Layer w0.254: LEDd11.1 8.67,3.05 9.58,3.96 10.81,3.96 11.71,3.05 LEDd12.1 15.02,3.05 15.93,3.96 17.16,3.96 18.06,3.05 LEDd13.1 26.96,9.32 R3.1
D2: length 25.3
  Top Layer w0.254: LEDd22.1 34.07,3.05 34.98,3.96 36.21,3.96 37.11,3.05 LEDd23.1 ; LEDd22.1 33.39,9.62 R4.1 ; LEDd22.1 30.76,3.05 29.86,3.96 28.63,3.96 27.72,3.05 LEDd21.1
D+: length 11.7
  Top Layer w0.254: U2.1 51,29.01 52.49,27.52 52.49,24.66 51.25,23.42 USB1.8 50.06,23.42 49.83,23.19 49.83,22.66 50.06,22.42 USB1.6
D-: length 13.3
  Top Layer w0.254: 51.61,21.92 51.61,22.74 51.44,22.92 USB1.7 ; 51.61,21.92 52.15,21.92 52.84,22.62 52.84,27.67 51.5,29.02 U2.2 ; 51.61,21.92 USB1.5
E1: length 32
  Top Layer w0.254: 5.21,41.14 5.21,28.44 v1(10.03,23.62) ; R1.1 13.98,13.16 v1(10.03,17.11)
  Bottom Layer w0.254: v1(10.03,23.62) v1(10.03,17.11)
E2: length 26.1
  Top Layer w0.254: R2.1 13.83,9.39 5.21,9.39 LEDe22.1 5.21,22.09
F1: length 52.6
  Top Layer w0.254: v1(17.27,57.66) 5.21,69.72 LEDf13.1 5.21,84.32 ; R8.2 v1(17.24,38.86)
  Bottom Layer w0.254: v1(17.24,38.86) 17.27,38.89 v1(17.27,57.66)
F2: length 36.5
  Top Layer w0.254: R7.2 v1(13.98,38.86) ; v1(14.22,50.55) 12.2,52.57 5.21,52.57 LEDf22.1 5.21,65.27
  Bottom Layer w0.254: v1(14.22,50.55) 14.22,39.1 v1(13.98,38.86)
G1: length 23.8
  Top Layer w0.254: R9.2 20.69,36.91 LEDg13.1 19.79,45.33 15.25,45.33 LEDg12.1 13.44,45.33 8.9,45.33 LEDg11.1
G2: length 25.3
  Top Layer w0.254: R12.2 30.27,43.01 LEDg21.1 27.04,46.49 27.82,47.26 32.36,47.26 LEDg22.1 34.3,47.14 38.84,47.14 LEDg23.1
MCU_RXD: length 88.5
  Top Layer w0.254: NOREF.1 50.16,64.28 50.16,64.28 50.16,47.78 52.13,45.81 52.13,38.78 52,38.65 U2.8 52,34.34 48.51,30.86 v1(48.51,26.8) ; v1(17.78,26.8) 16.51,26.8 14.73,25.02 U1.2 14.73,17.02 13.98,16.27 R1.2
  Bottom Layer w0.254: v1(48.51,26.8) v1(17.78,26.8)
MCU_TXD: length 93.6
  Top Layer w0.254: 47.69,31.44 50.41,34.16 51.17,34.16 51.5,34.48 U2.9 ; 47.69,31.44 v1(47.69,25.72) ; 47.69,31.44 47.69,68.01 NOREF#5.1 ; R2.2 17.24,15.91 16,17.15 U1.3 16,23.81 v1(17.78,25.59)
  Bottom Layer w0.254: v1(47.69,25.72) 47.56,25.59 v1(17.78,25.59)
P1.3: length 53.7
  Top Layer w0.254: U1.15 19.81,30.99 22.7,33.87 24.56,33.87 25.4,34.72 R11.1 28.45,36.15 28.45,42.29 25.91,44.83 25.91,47.88 27.01,48.98 27.01,61.14 SW2.4 SW2.3
P1.4: length 50.9
  Top Layer w0.254: SW1.4 SW1.3 23.75,60.2 23.75,38.37 22.79,37.4 22.79,36.03 23.75,35.07 R10.1 22.14,34.72 21.46,34.04 21.46,34.03 21.3,33.87 21.3,33.87 18.54,31.12 U1.16
RST: length 23.1
  Top Layer w0.254: R16.2 14.86,28.05 13.46,26.65 U1.1
XTAL1: length 23.1
  Top Layer w0.254: X1.3 X1.2 19.29,22.47 18.54,21.72 U1.5 18.67,20.03 18.67,18.63 22.7,14.6 C2.2
XTAL2: length 24.3
  Top Layer w0.254: X1.4 X1.1 19.72,24.67 17.27,22.23 U1.4 17.27,17.56 20.23,14.6 C1.2
$1N3494: length 10.3
  Top Layer w0.254: R3.2 25.28,14.8 24.5,15.59 22.77,15.59 19.81,18.54 U1.6
$1N3501: length 12.4
  Top Layer w0.254: U1.7 21.08,18.41 23.5,16 29.02,16 R4.2
$1N3506: length 14.4
  Top Layer w0.254: U1.8 22.35,18.41 24.38,16.38 31.62,16.38 33.2,14.8 R5.2
$1N3513: length 16.2
  Top Layer w0.254: U1.9 23.62,18.67 25.55,16.74 34.79,16.74 R6.2
$1N3908: length 5.4
  Top Layer w0.254: R7.1 14.73,33.97 U1.19
$1N3914: length 5.6
  Top Layer w0.254: U1.18 16,33.48 R8.1
$1N3950: length 6.4
  Top Layer w0.254: R9.1 17.27,31.49 U1.17
$1N3974: length 12.1
  Top Layer w0.254: R12.1 29.83,34.72 27.88,32.77 22.86,32.77 21.08,30.99 U1.14
$1N3981: length 14
  Top Layer w0.254: U1.13 22.35,30.86 23.5,32 30.81,32 R13.1
$1N3991: length 15.9
  Top Layer w0.254: U1.12 23.62,30.73 24.13,31.24 33.31,31.24 R14.1
$2N475: length 9.6
  Top Layer w0.254: C3.1 50.16,43.09 50.16,37.72 51,36.89 U2.10
$2N528: length 4.6
  Top Layer w0.254: C4.1 53.15,38.35 52.5,37.71 U2.7
$2N806: length 28.2
  Top Layer w0.254: v1(49.15,28.07) 49.56,28.47 49.56,31.04 53,34.48 U2.6 ; R15.1 v1(33.21,28.05) R16.1
  Bottom Layer w0.254: v1(33.21,28.05) 49.13,28.05 v1(49.15,28.07)
$2N1309: length 9.4
  Top Layer w0.254: R17.2 50.94,16.46 52.49,18 52.49,20.92 51.98,21.42 50.66,21.42
$2N1314: length 16.2
  Top Layer w0.254: v1(49.47,23.83) 50.06,24.42 50.66,24.42 ; R18.1 v1(49.47,11.16)
  Bottom Layer w0.254: v1(49.47,11.16) v1(49.47,23.83)

## Copper pours and planes (outline as drawn; the poured copper is in the pictures)
GND on Top Layer: -5.82,96.24 65.3,96.24 65.3,-9.17 -5.82,-9.17
GND on Bottom Layer: -5.93,97.16 65.28,97.16 65.28,-8.14 -5.93,-8.14

## Text on the board
Top Silkscreen Layer: 5V | GND | TXD | RXD | 刘张豪 / anran0@foxmail.com
